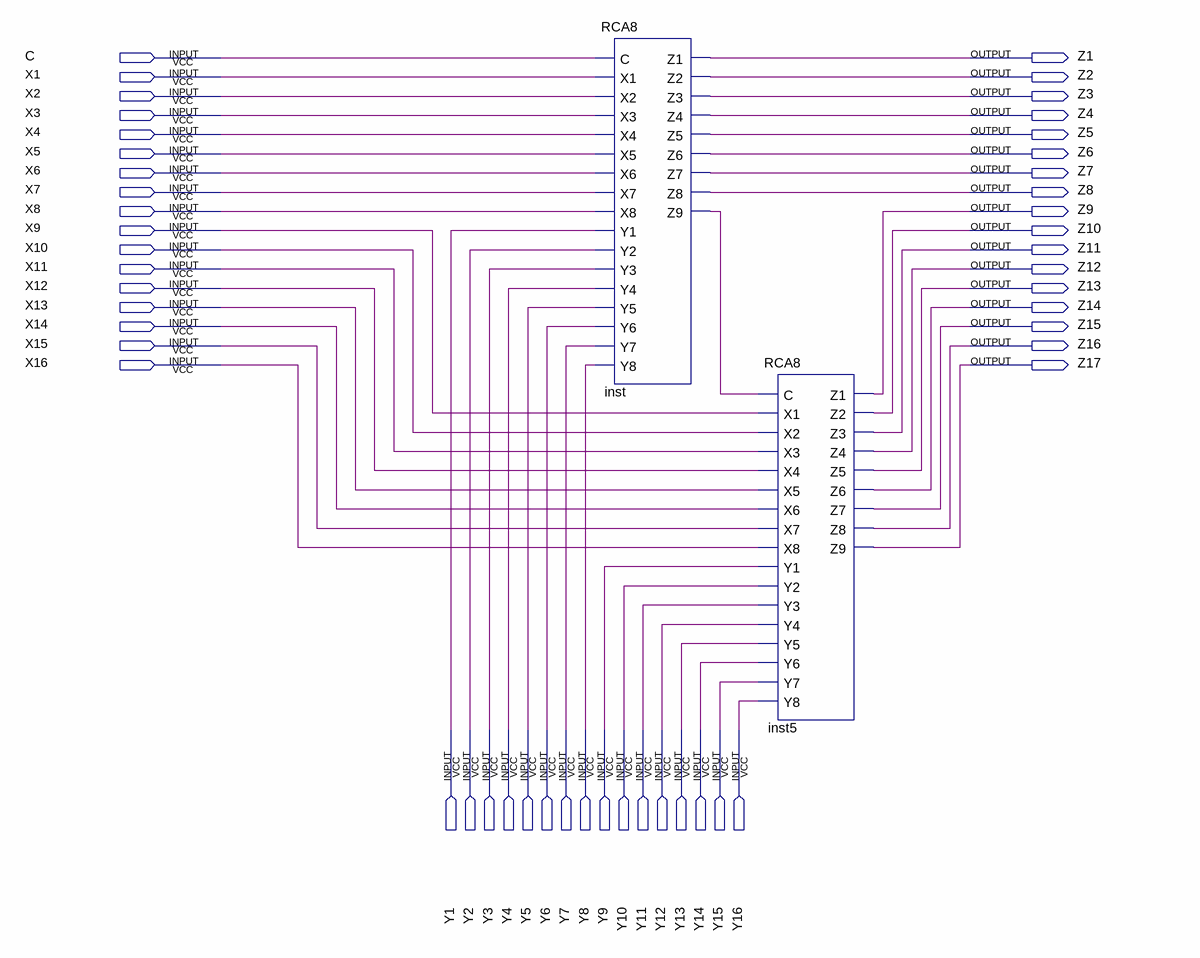
[diagram p0: schematic sheet]
// Quartus schematic RCA16.bdf as structural Verilog: 2 symbols, 50 pins
module RCA16 (
  input  C,
  input  X1,
  input  X2,
  input  X3,
  input  X4,
  input  X5,
  input  X6,
  input  X7,
  input  X8,
  input  X9,
  input  X10,
  input  X11,
  input  X12,
  input  X13,
  input  X14,
  input  X15,
  input  X16,
  input  Y1,
  input  Y2,
  input  Y3,
  input  Y4,
  input  Y5,
  input  Y6,
  input  Y7,
  input  Y8,
  input  Y9,
  input  Y10,
  input  Y11,
  input  Y12,
  input  Y13,
  input  Y14,
  input  Y15,
  input  Y16,
  output Z1,
  output Z2,
  output Z3,
  output Z4,
  output Z5,
  output Z6,
  output Z7,
  output Z8,
  output Z9,
  output Z10,
  output Z11,
  output Z12,
  output Z13,
  output Z14,
  output Z15,
  output Z16,
  output Z17
);

  wire inst_z9;

  RCA8 inst (
    .C(C), .X1(X1), .X2(X2), .X3(X3), .X4(X4), .X5(X5), .X6(X6), .X7(X7), .X8(X8), .Y1(Y1), .Y2(Y2), .Y3(Y3),
    .Y4(Y4), .Y5(Y5), .Y6(Y6), .Y7(Y7), .Y8(Y8), .Z1(Z1), .Z2(Z2), .Z3(Z3), .Z4(Z4), .Z5(Z5), .Z6(Z6),
    .Z7(Z7), .Z8(Z8), .Z9(inst_z9));
  RCA8 inst5 (
    .C(inst_z9), .X1(X9), .X2(X10), .X3(X11), .X4(X12), .X5(X13), .X6(X14), .X7(X15), .X8(X16), .Y1(Y9),
    .Y2(Y10), .Y3(Y11), .Y4(Y12), .Y5(Y13), .Y6(Y14), .Y7(Y15), .Y8(Y16), .Z1(Z9), .Z2(Z10), .Z3(Z11),
    .Z4(Z12), .Z5(Z13), .Z6(Z14), .Z7(Z15), .Z8(Z16), .Z9(Z17));
endmodule
